# Altium schematic sheet PAGE116.SchDoc
size 246 x 182 mm
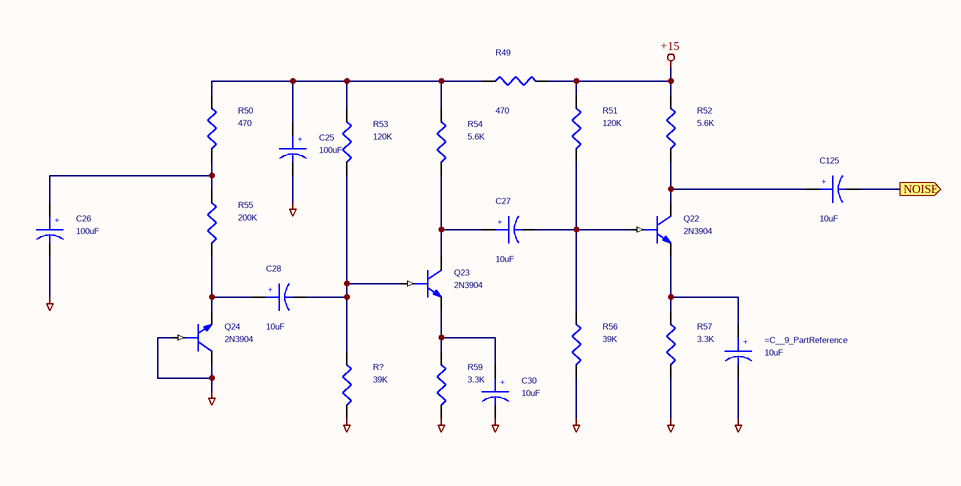
[diagram p0: PAGE116.SchDoc]

## Parts
=C__9_PartReference  10uF  [RB5/2]
C25  100uF  [RB0.3/0.1]
C26  100uF  [RB0.3/0.1]
C27  10uF  [RB5/2]
C28  10uF  [RB5/2]
C30  10uF  [RB5/2]
C125  10uF  [RB5/2]
Q22  2N3904  [TO92]
Q23  2N3904  [TO92]
Q24  2N3904  [TO92]
R49  470  [AXIAL0.4]
R50  470  [AXIAL0.4]
R51  120K  [AXIAL0.4]
R52  5.6K  [AXIAL0.4]
R53  120K  [AXIAL0.4]
R54  5.6K  [AXIAL0.4]
R55  200K  [AXIAL0.4]
R56  39K  [AXIAL0.4]
R57  3.3K  [AXIAL0.4]
R59  3.3K  [AXIAL0.4]
R?  39K  [AXIAL0.4]

## Ports
NOISE (out)

## Nets
+15: R49.2 R51.1 R52.1
AGND: =C__9_PartReference.2 C25.2 C26.2 C30.2 Q24.BASE Q24.COLLECTOR R56.2 R57.2 R59.2 R?.2
NOISE: C125.2 ; port NOISE
Net=C__9_PartReference_1: =C__9_PartReference.1 Q22.EMITTER R57.1
NetC25_1: C25.1 R49.1 R50.1 R53.1 R54.1
NetC26_1: C26.1 R50.2 R55.1
NetC27_1: C27.1 Q23.COLLECTOR R54.2
NetC27_2: C27.2 Q22.BASE R51.2 R56.1
NetC28_1: C28.1 Q24.EMITTER R55.2
NetC28_2: C28.2 Q23.BASE R53.2 R?.1
NetC30_1: C30.1 Q23.EMITTER R59.1
NetC125_1: C125.1 Q22.COLLECTOR R52.2

## Notes on the sheet
- (in symbol CAPACITOR POL) +

## Library data of the parts
=C__9_PartReference C25-C28 C30 C125 = CAPACITOR POL
  =C__9_PartReference: MOUSER PN: 667-EEA-GA1E100; PCB_Footprint: =C__9_PCB_Footprint
  C25 C26: MOUSER PN: 667-EEU-FR1E101
  C27 C28 C30 C125: MOUSER PN: 667-EEA-GA1E100
Q22-Q24 = NPN: DIGIKEY PN: 2N3904FS-ND
R49-R57 R59 R? = R_Dup1
  R49 R50: MOUSER PN: 271-470-RC
  R51 R53: MOUSER PN: 271-120K-RC
  R52 R54: MOUSER PN: 271-5.6K-RC
  R55: MOUSER PN: 271-200K-RC
  R56 R?: MOUSER PN: 271-39K-RC
  R57 R59: MOUSER PN: 271-3.3K-RC